# Altium project SNI_PROTO_1.1.PrjPcb
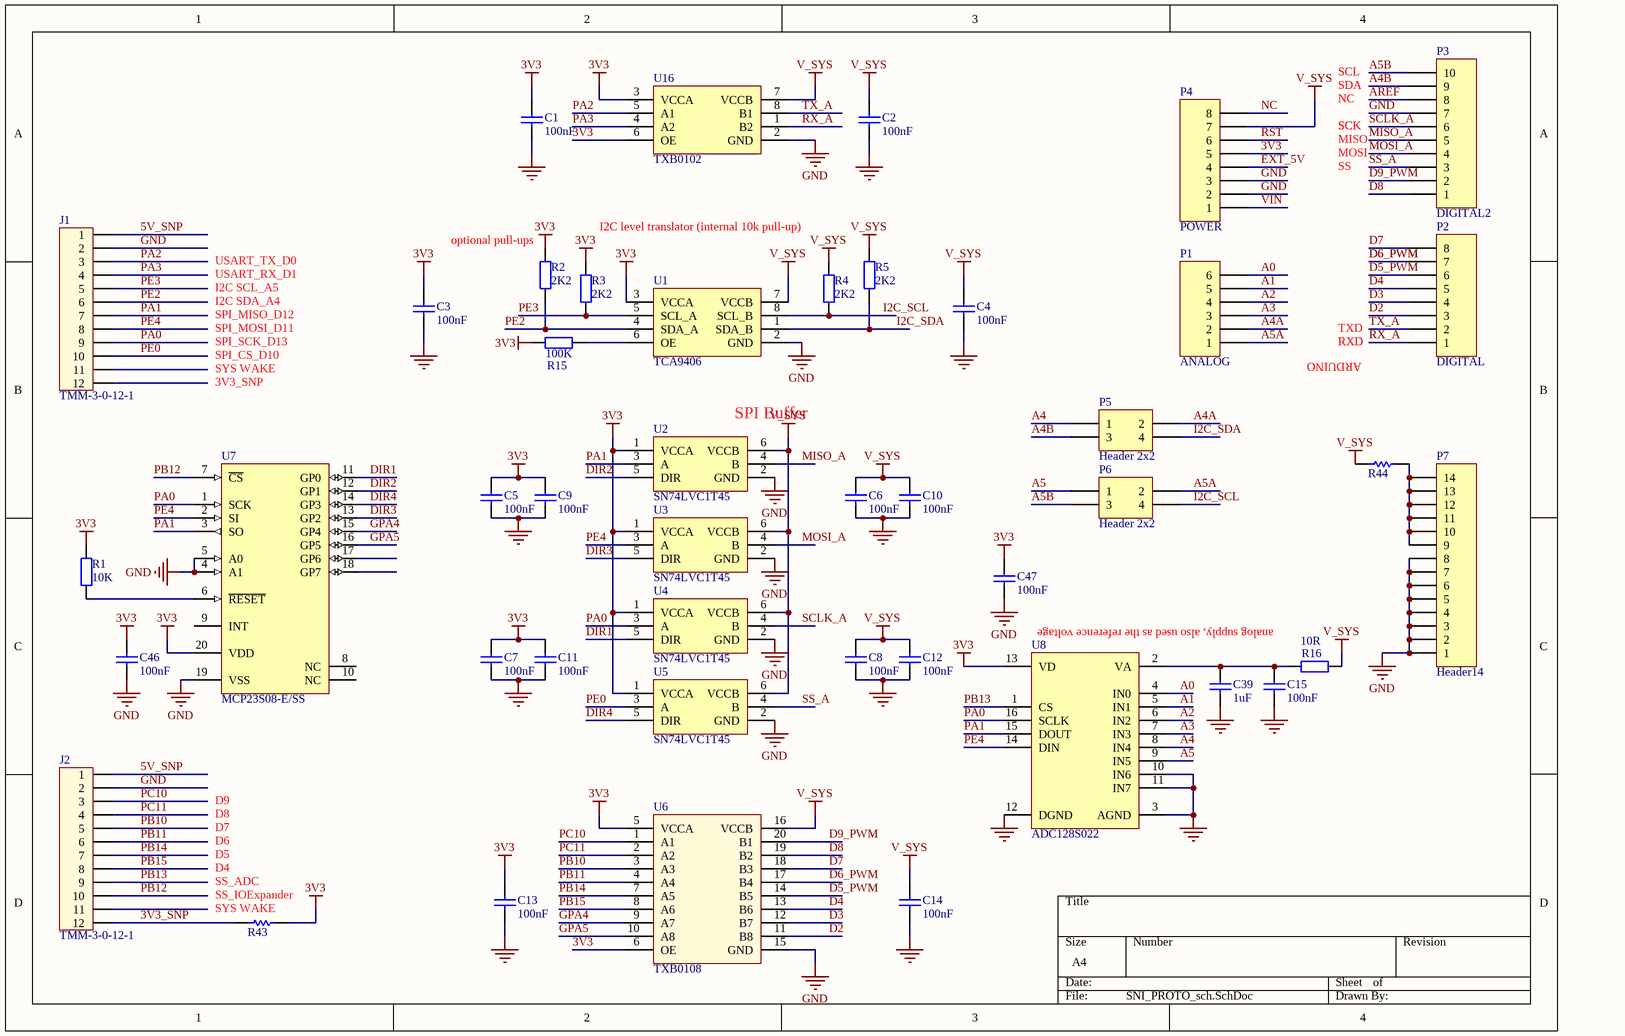
[diagram p0: SNI_PROTO_sch.SchDoc]
3 sheets, 99 parts. Net scope: global (net labels, ports and power ports of the same name join across sheets).
Board file: SNI_PROTO.PcbDoc
Sheets:
  SNI_PROTO_sch.SchDoc
  power.SchDoc
  USB.SchDoc

## Sheet SNI_PROTO_sch.SchDoc
size A4

### Parts
C1  value 100nF  [CAPC0402(1005)60_L]  (hidden comment: CAP 100nF 10V 0402(1005))
C2  value 100nF  [CAPC0402(1005)60_L]  (hidden comment: CAP 100nF 10V 0402(1005))
C3  value 100nF  [CAPC0402(1005)60_L]  (hidden comment: CAP 100nF 10V 0402(1005))
C4  value 100nF  [CAPC0402(1005)60_L]  (hidden comment: CAP 100nF 10V 0402(1005))
C5  value 100nF  [CAPC0402(1005)60_L]  (hidden comment: CAP 100nF 10V 0402(1005))
C6  value 100nF  [CAPC0402(1005)60_L]  (hidden comment: CAP 100nF 10V 0402(1005))
C7  value 100nF  [CAPC0402(1005)60_L]  (hidden comment: CAP 100nF 10V 0402(1005))
C8  value 100nF  [CAPC0402(1005)60_L]  (hidden comment: CAP 100nF 10V 0402(1005))
C9  value 100nF  [CAPC0402(1005)60_L]  (hidden comment: CAP 100nF 10V 0402(1005))
C10  value 100nF  [CAPC0402(1005)60_L]  (hidden comment: CAP 100nF 10V 0402(1005))
C11  value 100nF  [CAPC0402(1005)60_L]  (hidden comment: CAP 100nF 10V 0402(1005))
C12  value 100nF  [CAPC0402(1005)60_L]  (hidden comment: CAP 100nF 10V 0402(1005))
C13  value 100nF  [CAPC0402(1005)60_L]  (hidden comment: CAP 100nF 10V 0402(1005))
C14  value 100nF  [CAPC0402(1005)60_L]  (hidden comment: CAP 100nF 10V 0402(1005))
C15  value 100nF  [CAPC0402(1005)60_L]  (hidden comment: CAP 100nF 10V 0402(1005))
C39  value 1uF  [CAPC0402(1005)60_L]  (hidden comment: CAP 1uF 10V 0402(1005))
C46  value 100nF  [CAPC0402(1005)60_L]  (hidden comment: CAP 100nF 10V 0402(1005))
C47  value 100nF  [CAPC0402(1005)60_L]  (hidden comment: CAP 100nF 10V 0402(1005))
J1  TMM-3-0-12-1  [TMM-3-0-12-1]
J2  TMM-3-0-12-1  [TMM-3-0-12-1]
P1  ANALOG  [H6A]
P2  DIGITAL  [H8A]
P3  DIGITAL2  [H10A]
P4  POWER  [H8A]
P5  Header 2x2  [H2x2]
P6  Header 2x2  [H2x2]
P7  Header14  [H14]
R1  value 10K  [RESC0402(1005)_L]  (hidden comment: 10K 1% 0402(1005))
R2  value 2K2  [RESC0402(1005)_L]  (hidden comment: 2K2 1% 0402(1005))
R3  value 2K2  [RESC0402(1005)_L]  (hidden comment: 2K2 1% 0402(1005))
R4  value 2K2  [RESC0402(1005)_L]  (hidden comment: 2K2 1% 0402(1005))
R5  value 2K2  [RESC0402(1005)_L]  (hidden comment: 2K2 1% 0402(1005))
R15  value 100K  [RESC0402(1005)_L]  (hidden comment: 100K 1% 0402(1005))
R16  value 10R  [RESC0603(1608)_N]  (hidden comment: 10R 1% 0603(1608))
R43  Jumper 0805(2012)  [RESC0805(2012)_N]  (value not drawn)
R44  1R 5% 1210(3225)  [RESC1210(3225)_N]  (value not drawn)
U1  TCA9406  [LSSOP-8]
U2  SN74LVC1T45  [SOT6_DRL]
U3  SN74LVC1T45  [SOT6_DRL]
U4  SN74LVC1T45  [SOT6_DRL]
U5  SN74LVC1T45  [SOT6_DRL]
U6  TXB0108  [UFDFN-20]
U7  MCP23S08-E/SS  [SSOP-SS20_N]
U8  ADC128S022  [TSSOP16]
U16  TXB0102  [VSSOP8]

### Nets
3V3: C1.1 C3.1 C5.1 C7.1 C9.2 C11.2 C13.2 C46.1 C47.1 P4.5 R1.2 R2.2 R3.2 R15.1 R43.2 U1.3(VCCA) U2.1(VCCA) U3.1(VCCA) U4.1(VCCA) U5.1(VCCA) U6.5(VCCA) U6.6(OE) U7.20(VDD) U8.13(VD) U16.3(VCCA) U16.6(OE)
5V_SNP: J1.1 J2.1
EXT_5V: P4.4
GND: C1.2 C2.2 C3.2 C4.2 C5.2 C6.2 C7.2 C8.2 C9.1 C10.1 C11.1 C12.1 C13.1 C14.1 C15.1 C39.1 C46.2 C47.2 J1.2 J2.2 P3.7 P4.2 P4.3 P7.1 P7.2 P7.3 P7.4 P7.5 P7.6 P7.7 P7.8 U1.2(GND) U2.2(GND) U3.2(GND) U4.2(GND) U5.2(GND) U6.15(GND) U7.4(A1) U7.5(A0) U7.19(VSS) U8.3(AGND) U8.10(IN6) U8.11(IN7) U8.12(DGND) U16.2(GND)
V_SYS: C2.1 C4.1 C6.1 C8.1 C10.2 C12.2 C14.2 P4.7 R4.2 R5.2 R16.2 R44.1 U1.7(VCCB) U2.6(VCCB) U3.6(VCCB) U4.6(VCCB) U5.6(VCCB) U6.16(VCCB) U16.7(VCCB)
3V3_SNP: J2.12 R43.1
A0: P1.6 U8.4(IN0)
A1: P1.5 U8.5(IN1)
A2: P1.4 U8.6(IN2)
A3: P1.3 U8.7(IN3)
A4: P5.1 U8.8(IN4)
A4A: P1.2 P5.2
A4B: P3.9 P5.3
A5: P6.1 U8.9(IN5)
A5A: P1.1 P6.2
A5B: P3.10 P6.3
AREF: P3.8
D2: P2.3 U6.11(B8)
D3: P2.4 U6.12(B7)
D4: P2.5 U6.13(B6)
D5_PWM: P2.6 U6.14(B5)
D6_PWM: P2.7 U6.17(B4)
D7: P2.8 U6.18(B3)
D8: P3.1 U6.19(B2)
D9_PWM: P3.2 U6.20(B1)
DIR1: U4.5(DIR) U7.11(GP0)
DIR2: U2.5(DIR) U7.12(GP1)
DIR3: U3.5(DIR) U7.13(GP2)
DIR4: U5.5(DIR) U7.14(GP3)
GPA4: U6.9(A7) U7.15(GP4)
GPA5: U6.10(A8) U7.16(GP5)
I2C_SCL: P6.4 R4.1 U1.8(SCL_B)
I2C_SDA: P5.4 R5.1 U1.1(SDA_B)
MISO_A: P3.5 U2.4(B)
MOSI_A: P3.4 U3.4(B)
NC: P4.8
PA0: J1.9 U4.3(A) U7.1(SCK) U8.16(SCLK)
PA1: J1.7 U2.3(A) U7.3(SO) U8.15(DOUT)
PA2: J1.3 U16.5(A1)
PA3: J1.4 U16.4(A2)
PB10: J2.5 U6.3(A3)
PB11: J2.6 U6.4(A4)
PB12: J2.10 U7.7(~{CS})
PB13: J2.9 U8.1(CS)
PB14: J2.7 U6.7(A5)
PB15: J2.8 U6.8(A6)
PC10: J2.3 U6.1(A1)
PC11: J2.4 U6.2(A2)
PE0: J1.10 U5.3(A)
PE2: J1.6 R2.1 U1.4(SDA_A)
PE3: J1.5 R3.1 U1.5(SCL_A)
PE4: J1.8 U3.3(A) U7.2(SI) U8.14(DIN)
RST: P4.6
RX_A: P2.1 U16.1(B2)
SCLK_A: P3.6 U4.4(B)
SS_A: P3.3 U5.4(B)
TX_A: P2.2 U16.8(B1)
VIN: P4.1
NetC15_2: C15.2 C39.2 R16.1 U8.2(VA)
NetP7_9: P7.9 P7.10 P7.11 P7.12 P7.13 P7.14 R44.2
NetR1_1: R1.1 U7.6(~{RESET})
NetR15_2: R15.2 U1.6(OE)

Not connected (* = marked no-connect by the designer): J1 11 12; J2 11; U7 8(NC) 9(INT) 10(NC) 17(GP6) 18(GP7)

### Notes on the sheet
- SCL
- SDA
- NC
- MISO
- SCK
- MOSI
- SS
- (near R2) optional pull-ups
- I2C level translator (internal 10k pull-up)
- USART_RX_D1
- USART_TX_D0
- I2C SCL_A5
- I2C SDA_A4
- SPI_SCK_D13
- SPI_MOSI_D11
- SPI_MISO_D12
- SPI_CS_D10
- SYS WAKE
- 3V3_SNP
- RXD
- TXD
- ARDUINO
- (near U2) SPI Buffer
- analog supply, also used as the reference voltage
- D6
- D7
- D8
- D9
- (near R43) SS_ADC
- (near R43) SS_IOExpander
- D5
- (near R43) D4
- (near R43) SYS WAKE

### Library data of the parts
C1-C15 C46 C47 = CMP-1034-02064-1: CAP 100nF 10V ±5% 0402 (1005 Metric) Thickness 0.6mm SMD; Tolerance: Â±5%; Case-EIA: 0402; Case-Metric: 1005; Max Thickness: 0.6 mm; Rated Voltage: 10 V; Technology: SMT
C39 = CMP-1034-02117-1: CAP 1uF 10V ±20% 0402 (1005 Metric) Thickness 0.6mm SMD; Case-Metric: 1005; Tolerance: Â±20%; Case-EIA: 0402; Max Thickness: 0.6 mm; Rated Voltage: 10 V; Technology: SMT
J1 J2 = TMM-3-0-12-1: PLUG, DIP, 1.27MM, 12WAY; Manufacturer: AMPHENOL; Supplier 1: Farnell; Supplier Part Number 1: 1865058; Manufacturer Part Number: TMM-3-0-12-1; Supplier 2: Digikey; Supplier 3: Mouser; Supplier Part Number 2: N/A; Supplier Part Number 3: N/A
P1 = header6A
P2 P4 = Header8A
P3 = Header10A
P5 P6 = Header
R1 = 10K 0402(1005)_1: 10K 0.063W 1% 0402 (1005 Metric)  SMD; Case-EIA: 0402; Case-Metric: 1005; Power: 0.063W; Technology: SMT; Tolerance: 1%
R2-R5 = 2K2 0402(1005): 2K2 0.063W 1% 0402 (1005 Metric)  SMD; Case-EIA: 0402; Case-Metric: 1005; Power: 0.063W; Technology: SMT; Tolerance: 1%
R15 = 100K 0402(1005): 100K 0.063W 1% 0402 (1005 Metric)  SMD; Case-EIA: 0402; Case-Metric: 1005; Power: 0.063W; Technology: SMT; Tolerance: 1%
R16 = 10R 0603(1608): 10R 0.1W 1% 0603 (1608 Metric)  SMD; Case-EIA: 0603; Case-Metric: 1608; Power: 0.1W; Technology: SMT; Tolerance: 1%
R43 = CMP-1013-00001-1: Jumper 0805 (2012 Metric); Case-EIA: 0805; Value: 0.00 Ohm; Tolerance: None; Case-Metric: 2012; Technology: SMT; Power: None
R44 = CMP-1015-00002-1: 1R 0.5W 5% 1210 (3225 Metric)  SMD; Case-EIA: 1210; Value: 1.00 Ohm; Case-Metric: 3225; Power: 0.5 W; Technology: SMT; Tolerance: 5 %
U6 = TXB0108: Translator, Bidirectional, 8 bits data rate 100Mbps; Manufacturer Part Number: TXB0108DQSR; Manufacturer: Texas Instruments; Supplier Part Number 1: 2352272; Supplier Part Number 2: 296-27217-1-ND; Supplier 1: Farnell; Supplier 2: Digikey; ComponentLink1URL: http://www.ti.com/lit/ds/symlink/txb0108.pdf; ComponentLink1Description: Datasheet; Supplier 3: Mouser; Supplier Part Number 3: 595-TXB0108DQSR; Mounting Style: SMD/SMT
U7 = MCP23S08-E/SS: 8-Bit I/O Expander with Serial Interface, 20-Pin SSOP, Extended Temperature; Published: 29-Jan-2009; DatasheetVersion: revE, Aug-2007; PackageVersion: revBB, Aug-2009; PackageReference: SSOP-SS20; Publisher: Altium Limited; PackageDescription: 20-Lead Plastic Shrink Small Outline (SS) - 5.3mm Body [SSOP]; Supplier 1: Digi-Key; Supplier Part Number 1: MCP23S08-E/SS-ND; Supplier 2: Farnell; Supplier Part Number 2: 1292236; Code_JEDEC: MO-150; Code_IPC: SOP65P780-20; ComponentLink1Description: Datasheet; ComponentLink1URL: http://ww1.microchip.com/downloads/en/DeviceDoc/21919e.pdf; ComponentLink2Description: Packaging Specification; ComponentLink2URL: http://www.microchip.com/stellent/groups/techpub_sg/documents/packagingspec/en012702.pdf; ComponentLink3Description: Microchip.com Home; ComponentLink3URL: http://www.microchip.com/
U1 = TCA9406: Supplier 1: Farnell; Supplier 2: Digi-Key; Supplier 3: Mouser; Supplier Part Number 1: 1972384; Supplier Part Number 2: 296-28108-1-ND; Supplier Part Number 3: 595-TCA9406DCTR
U2-U5 = SN74LVC1T45: Supplier 1: Farnell; Supplier 2: Digi_Key; Supplier 3: Mouser; Supplier Part Number 1: N/A; Supplier Part Number 2: 296-20629-1-ND; Supplier Part Number 3: 595-SN74LVC1T45DRLR
U8 = ADC128S022: Supplier 1: Farnell; Supplier 2: Digi-Key; Supplier 3: Mouser; Supplier Part Number 1: 2496156; Supplier Part Number 2: 296-38561-2-ND; Supplier Part Number 3: 926-A128S022CIMTXNPB
U16 = TXB0102: Supplier 1: Farnell; Supplier 2: Digi_Key; Supplier 3: Mouser; Supplier Part Number 1: 2295723; Supplier Part Number 3: 595-TXB0102DCUR; Supplier Part Number 2: 296-22862-1-ND

## Sheet power.SchDoc
size A4
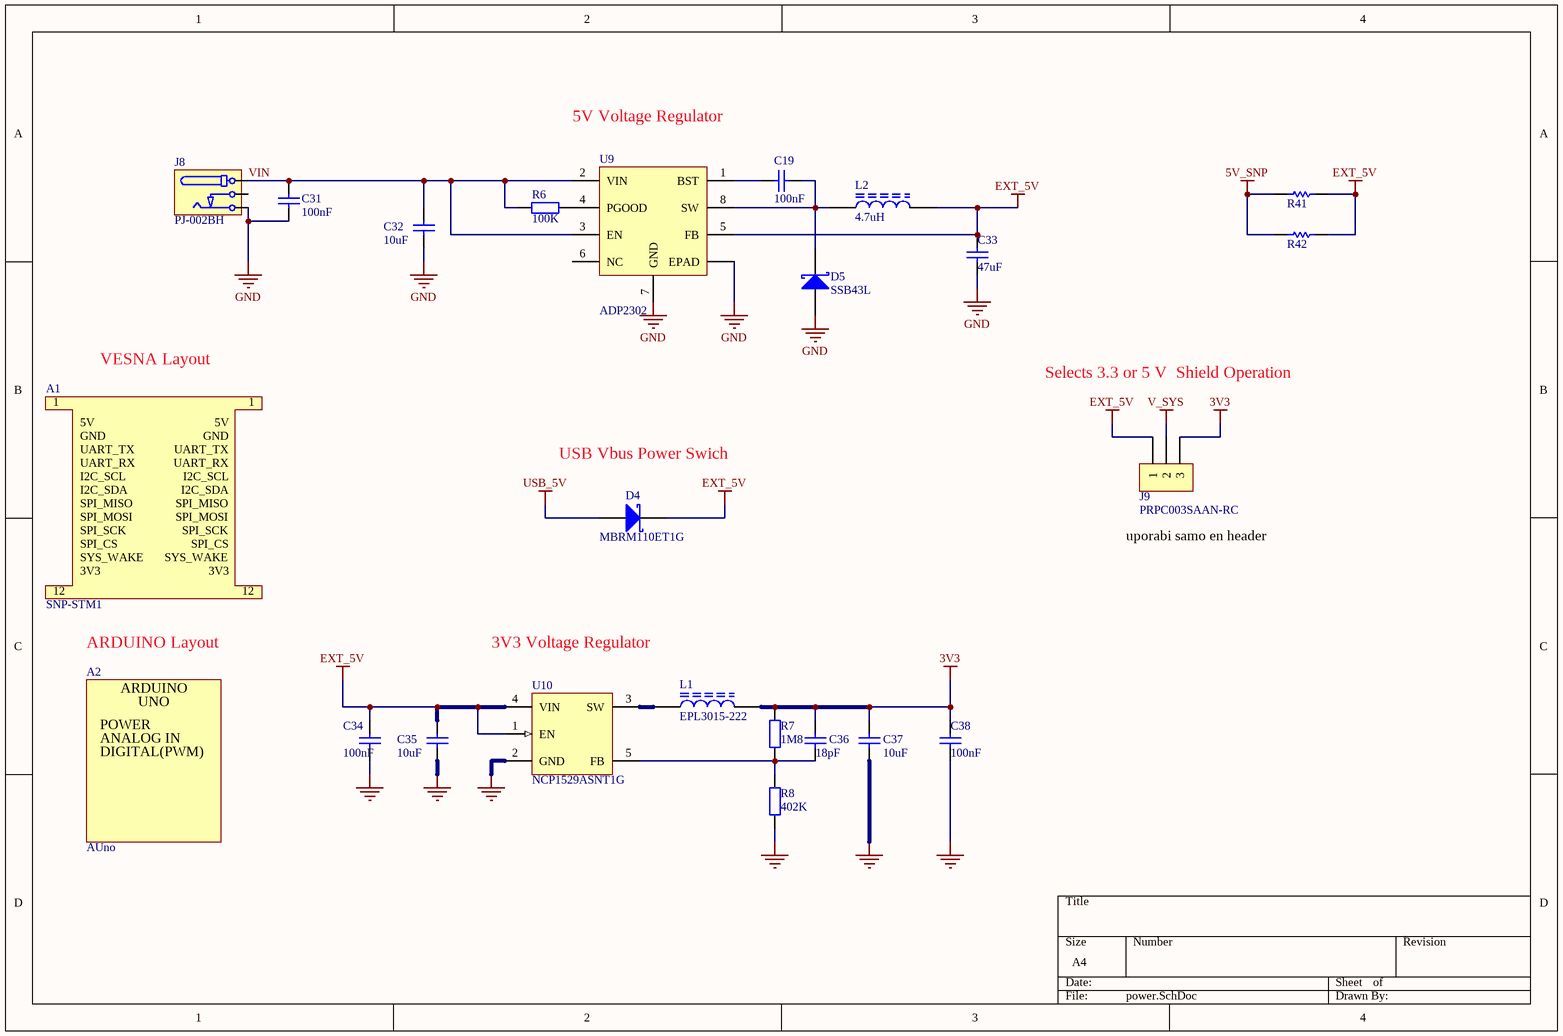
[diagram p1: power.SchDoc]

### Parts
A1  SNP-STM1  [SNP-STM1]  (no BOM)
A2  AUno  [PCBComponent_1]
C19  value 100nF  [CAPC0402(1005)60_L]  (hidden comment: CAP 100nF 10V 0402(1005))
C31  value 100nF  [CAPC0402(1005)60_M]  (hidden comment: CAP 100nF 50V 0402(1005))
C32  10uF  [CAPC0805(2012)145_N]
C33  value 47uF  [CAPC0402(1005)60_M]  (hidden comment: CAP 100nF 50V 0402(1005))
C34  value 100nF  [CAPC0402(1005)60_M]  (hidden comment: CAP 100nF 50V 0402(1005))
C35  10uF  [CAPC0805(2012)145_N]
C36  value 18pF  [CAPC0402(1005)60_M]  (hidden comment: CAP 18pF 50V 0402(1005))
C37  10uF  [CAPC0805(2012)145_N]
C38  value 100nF  [CAPC0402(1005)60_M]  (hidden comment: CAP 100nF 50V 0402(1005))
D4  MBRM110ET1G  [CASE 457–04]
D5  SSB43L  [CASE 457–04]
J8  PJ-002BH  [PJ-002BH]
J9  PRPC003SAAN-RC  [PRPC003SAAN-RC]
L1  EPL3015-222  [EPL3015-222_L]
L2  4.7uH  [EPL3015-222_L]
R6  value 100K  [RESC0402(1005)_M]  (hidden comment: 100K 1% 0402(1005))
R7  value 1M8  [RESC0402(1005)_L]  (hidden comment: 1M8 1% 0402(1005))
R8  value 402K  [RESC0402(1005)_L]  (hidden comment: 402K 1% 0402(1005))
R41  Jumper 0805(2012)  [RESC0805(2012)_N]  (value not drawn)
R42  Jumper 0805(2012)  [RESC0805(2012)_N]  (value not drawn)
U9  ADP2302  [SOP127P600-8N]
U10  NCP1529ASNT1G  [SOT-23-5_L]

### Nets
3V3: C36.2 C37.2 C38.2 J9.3 L1.2 R7.2
5V_SNP: R41.1 R42.1
EXT_5V: C33.2 C34.2 C35.2 D4.1(K) J9.1 L2.2 R41.2 R42.2 U9.5(FB) U10.1(EN) U10.4(VIN)
GND: C31.2 C32.1 C33.1 C34.1 C35.1 C37.1 C38.1 D5.2(A) J8.2(T) R8.1 U9.7(GND) U9.9(EPAD) U10.2(GND)
USB_5V: D4.2(A)
V_SYS: J9.2
VIN: C31.1 C32.2 J8.1(S) R6.1 U9.2(VIN) U9.3(EN)
NetC19_1: C19.1 U9.1(BST)
NetC19_2: C19.2 D5.1(K) L2.1 U9.8(SW)
NetC36_1: C36.1 R7.1 R8.2 U10.5(FB)
NetL1_1: L1.1 U10.3(SW)
NetR6_2: R6.2 U9.4(PGOOD)

Not connected (* = marked no-connect by the designer): J8 3(R); U9 6(NC)

### Notes on the sheet
- 5V Voltage Regulator
- VESNA Layout
- Selects 3.3 or 5 V  Shield Operation
- USB Vbus Power Swich
- uporabi samo en header
- ARDUINO Layout
- 3V3 Voltage Regulator
- (in symbol AUno) ARDUINO; UNO; POWER; ANALOG IN; DIGITAL(PWM)
- (in symbol SNP-STM1) 1; 5V; GND; UART_TX; UART_RX; I2C_SCL; I2C_SDA; SPI_MISO; SPI_MOSI; SPI_SCK; SPI_CS; SYS_WAKE; 3V3; 12

### Library data of the parts
A1 = SNP-STM1: SNP-STM1 Vesna Processor Module, Mechanical PCB Components without Connectors
C19 = CMP-1034-02064-1: as C1 on sheet SNI_PROTO_sch; Max Thickness: 0.6 mm; Rated Voltage: 10 V; Technology: SMT
C31 C33 C34 C38 = CMP-1034-02077-1: CAP 100nF 50V ±10% 0402 (1005 Metric) Thickness 0.6mm SMD; Case-Metric: 1005; Case-EIA: 0402; Rated Voltage: 50 V; Technology: SMT; Tolerance: ±10%; Max Thickness: 0.6 mm
C32 C35 C37 = CMP-1036-04924-1: CAP 10uF 10V ±20% 0805 (2012 Metric) Thickness 1.45mm SMD; Case-EIA: 0805; Case-Metric: 2012; Rated Voltage: 10 V; Max Thickness: 1.45 mm; Value: 10uF; Technology: SMT; Tolerance: ±20%
C36 = CMP-1034-00862-1: CAP 18pF 50V ±1% 0402 (1005 Metric) Thickness 0.6mm SMD; Case-Metric: 1005; Case-EIA: 0402; Tolerance: ±1%; Max Thickness: 0.6 mm; Technology: SMT; Rated Voltage: 50 V
D4 D5 = MBRM110ET1G: Diode, Schottky Power Rectifier, SMT, 1A, 10V; Supplier 1: Farnell; Supplier 2: Digi-Key; Supplier 3: Mouser; Supplier Part Number 1: 2369429; Supplier Part Number 2: MBRM110ET1GOSCT-ND; Supplier Part Number 3: 863-MBRM110ET1G
J9 = PRPC003SAAN-RC: Pin header male 3 pin  Through Hole Vertical, Pitch 2.54 mm; Supplier Part Number 1: *; Supplier Part Number 2: S1011EC-40-ND; Supplier Part Number 3: *; Supplier 1: Farnell; Supplier 2: Digi-key; Supplier 3: Mouser
L1 = EPL3015-222: Shielded Power Inductors, 2.2uH, Isat 1.6A @ 30%, Irms 2A @ 40°C, 3 x 3 x 1.5mm; Supplier 1: Farnell; Supplier 2: Mouser; Supplier Part Number 1: 2287410; Supplier Part Number 2: 994-EPL3015-222MLB
L2 = EPL3015-472MLB: Shielded Power Inductors, 4.7uH, Isat 1.6A @ 30%, Irms 1.4A @ 40°C, 3 x 3 x 1.5mm; Manufacturer: COILCRAFT; Supplier 1: Farnell; Supplier 2: Mouser; Supplier Part Number 1: 2287412; Supplier Part Number 2: 994-EPL3015-472MLB; ComponentLink1URL: http://www.farnell.com/datasheets/1681919.pdf; ComponentLink1Description: Datasheet; Manufacturer Part Number: EPL3015-472MLB; Supplier 3: *; Supplier Part Number 3: *
R6 = 100K 0402(1005): as R15 on sheet SNI_PROTO_sch; Power: 0.063W; Technology: SMT; Tolerance: 1%
R7 = 1M8 0402(1005): 1M8 0.063W 1% 0402 (1005 Metric)  SMD; Case-EIA: 0402; Case-Metric: 1005; Power: 0.063W; Technology: SMT; Tolerance: 1%
R8 = 402K 0402(1005): 402K 0.063W 1% 0402 (1005 Metric)  SMD; Case-EIA: 0402; Case-Metric: 1005; Power: 0.063W; Technology: SMT; Tolerance: 1%
R41 R42 = CMP-1013-00001-1: as R43 on sheet SNI_PROTO_sch; Technology: SMT; Power: None
U10 = NCP1529A: 1 A, 1.7 MHz Low Voltage Buck Converter; Supplier 1: Farnell; Supplier 2: Digi-Key; Supplier 3: Mouser; Supplier Part Number 1: 2112613; Supplier Part Number 2: NCP1529ASNT1GOSCT-ND; Supplier Part Number 3: 863-NCP1529ASNT1G
J8 = PJ-002BH: Supplier Part Number 2: CP-002BH-ND; Supplier 2: Digi-Key; Supplier Part Number 3: 490-PJ-002BH; Supplier Part Number 1: *; Supplier 1: Farnell; Supplier 3: Mouser
U9 = ADP2302: Supplier 1: Farnell; Supplier 2: Digi-Key; Supplier 3: Maouser; Supplier Part Number 3: 584-ADP2302ARDZ5.0R7; Supplier Part Number 2: ADP2302ARDZ-5.0-R7TR-ND; Supplier Part Number 1: *

## Sheet USB.SchDoc
size A4
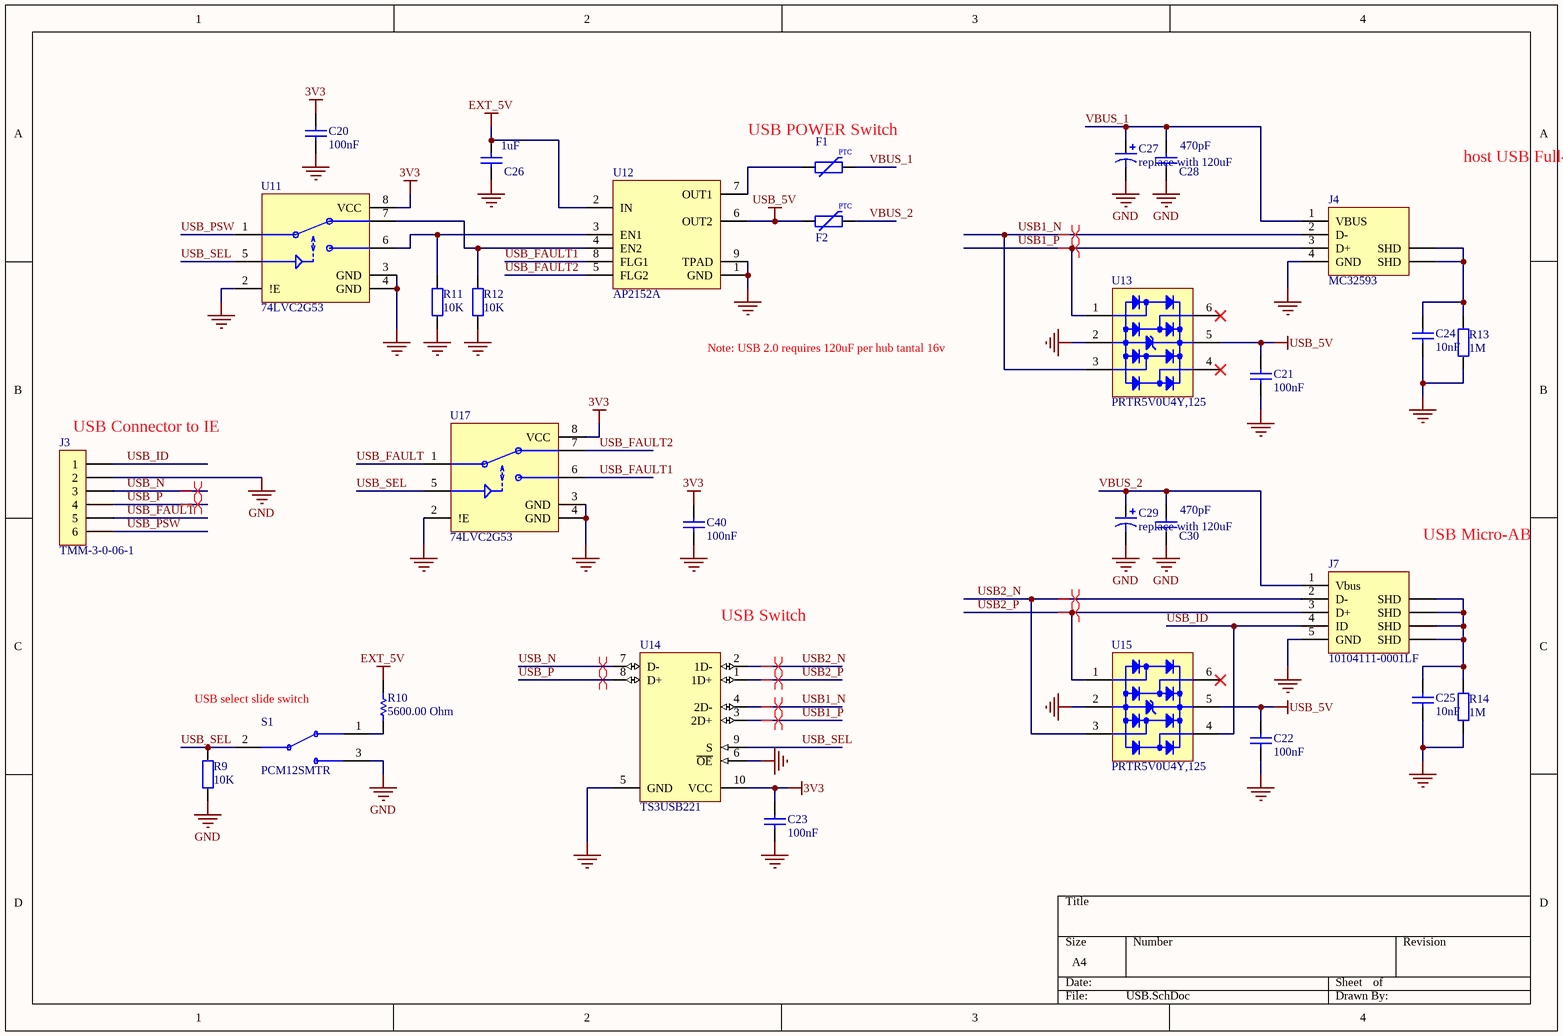
[diagram p2: USB.SchDoc]

### Parts
C20  value 100nF  [CAPC0402(1005)60_L]  (hidden comment: CAP 100nF 10V 0402(1005))
C21  value 100nF  [CAPC0402(1005)60_L]  (hidden comment: CAP 100nF 10V 0402(1005))
C22  value 100nF  [CAPC0402(1005)60_L]  (hidden comment: CAP 100nF 10V 0402(1005))
C23  value 100nF  [CAPC0402(1005)60_L]  (hidden comment: CAP 100nF 10V 0402(1005))
C24  value 10nF  [CAPC0402(1005)60_N]  (hidden comment: CAP 10nF 50V 0402(1005))
C25  value 10nF  [CAPC0402(1005)60_N]  (hidden comment: CAP 10nF 50V 0402(1005))
C26  value 1uF  [CAPC0603(1608)100_N]  (hidden comment: CAP 2.2uF 16V 0603(1608))
C27  replace with 120uF  [AVX-CAPC3528_V]
C28  value 470pF  [CAPC0603(1608)100_M]  (hidden comment: CAP 470pF 16V 0603(1608))
C29  replace with 120uF  [AVX-CAPC3528_V]
C30  value 470pF  [CAPC0603(1608)100_M]  (hidden comment: CAP 470pF 16V 0603(1608))
C40  value 100nF  [CAPC0402(1005)60_L]  (hidden comment: CAP 100nF 10V 0402(1005))
F1  MF-PSMF050X-2  [RESC0805(2012)_L]  (value not drawn)
F2  MF-PSMF050X-2  [RESC0805(2012)_L]  (value not drawn)
J3  TMM-3-0-06-1  [Micro-Match_6pin]
J4  MC32593  [MC32593]
J7  10104111-0001LF  [10104111-0001LF]
R9  value 10K  [RESC0402(1005)_L]  (hidden comment: 10K 1% 0402(1005))
R10  value 5600.00 Ohm  [RESC0402(1005)_L]  (hidden comment: 5K6 5% 0402(1005))
R11  value 10K  [RESC0402(1005)_N]  (hidden comment: 10K 1% 0402(1005))
R12  value 10K  [RESC0402(1005)_N]  (hidden comment: 10K 1% 0402(1005))
R13  value 1M  [RESC0402(1005)_L]  (hidden comment: 1M  1% 0402(1005))
R14  value 1M  [RESC0402(1005)_L]  (hidden comment: 1M  1% 0402(1005))
S1  PCM12SMTR  [PCM12SMTR switch footprint]
U11  74LVC2G53  [VSSOP8_SOT765-1]
U12  AP2152A  [SOP127P600-8N]
U13  PRTR5V0U4Y,125  [SOT363_L]
U14  TS3USB221  [RSE10]
U15  PRTR5V0U4Y,125  [SOT363_L]
U17  74LVC2G53  [VSSOP8_SOT765-1]

### Nets
3V3: C20.2 C23.2 C40.2 U11.8(VCC) U14.10(VCC) U17.8(VCC)
EXT_5V: C26.2 R10.2 U12.2(IN)
GND: C20.1 C21.1 C22.1 C23.1 C24.1 C25.1 C26.1 C27.2 C28.1 C29.2 C30.1 C40.1 J3.2 J4.4(GND) J7.5(GND) R9.1 R11.1 R12.1 R13.1 R14.1 S1.3(NC2) U11.2(!E) U11.3(GND) U11.4(GND) U12.1(GND) U12.9(TPAD) U13.2 U14.5(GND) U14.6(~{OE}) U15.2 U17.2(!E) U17.3(GND) U17.4(GND)
USB_5V: C21.2 C22.2 F2.1 U12.6(OUT2) U13.5 U15.5
USB1_N: J4.2(D-) U13.3 U14.4(2D-)
USB1_P: J4.3(D+) U13.1 U14.3(2D+)
USB2_N: J7.2(D-) U14.2(1D-) U15.3
USB2_P: J7.3(D+) U14.1(1D+) U15.1
USB_FAULT: J3.5 U17.1(Z)
USB_FAULT1: U12.8(FLG1) U17.6(Y1)
USB_FAULT2: U12.5(FLG2) U17.7(Y0)
USB_ID: J3.1 J7.4(ID) U15.4
USB_N: J3.3 U14.7(D-)
USB_P: J3.4 U14.8(D+)
USB_PSW: J3.6 U11.1(Z)
USB_SEL: R9.2 S1.2(NO1) U11.5(S) U14.9(S) U17.5(S)
VBUS_1: C27.1 C28.2 F1.2 J4.1(VBUS)
VBUS_2: C29.1 C30.2 F2.2 J7.1(Vbus)
NetC24_2: C24.2 J4.5(SHD) J4.6(SHD) R13.2
NetC25_2: C25.2 J7.6(SHD) J7.7(SHD) J7.8(SHD) J7.9(SHD) R14.2
NetF1_1: F1.1 U12.7(OUT1)
NetR10_1: R10.1 S1.1(NC1)
NetR11_2: R11.2 U11.6(Y1) U12.3(EN1)
NetR12_2: R12.2 U11.7(Y0) U12.4(EN2)

Not connected (* = marked no-connect by the designer): U13 4* 6*; U15 6*

### Layout directives
differential pair: USB1_N, USB1_P, USB2_N, USB2_P, USB_N, USB_P

### Notes on the sheet
- USB POWER Switch
- host USB Full-size type A
- Note: USB 2.0 requires 120uF per hub tantal 16v
- (near J3) USB Connector to IE
- (near J7) USB Micro-AB
- (near U14) USB Switch
- (near S1) USB select slide switch
- (in symbol MF-PSMF050X-2) PTC

### Library data of the parts
C20-C23 C40 = CMP-1034-02064-1: as C1 on sheet SNI_PROTO_sch; Max Thickness: 0.6 mm; Rated Voltage: 10 V; Technology: SMT
C24 C25 = CMP-1034-01886-1: CAP 10nF 50V ±10% 0402 (1005 Metric) Thickness 0.6mm SMD; Case-EIA: 0402; Case-Metric: 1005; Tolerance: ±10%; Rated Voltage: 50 V; Max Thickness: 0.6 mm; Technology: SMT
C26 = CMP-1035-02765-1: CAP 2.2uF 16V ±20% 0603 (1608 Metric) Thickness 1mm SMD; Case-EIA: 0603; Case-Metric: 1608; Max Thickness: 1 mm; Rated Voltage: 16 V; Tolerance: ±20%; Technology: SMT
C27 C29 = CMP-0279-00001-1: Capacitor, Tantalum, 10uF 10% 20V MCCT-B (3528); PartNumber: TAJB106K020R; Manufacturer: AVX; Polarity: Polarized; PackageDescription: 2-Pin SMT Capacitor, 3.5 x 2.8 mm Body; ComponentLink1URL: http://www.avx.com/; PackageReference: CAPC3528; ComponentLink2Description: Datasheet; Capacitance: 10uF; Technology: Tantalum; ComponentLink2URL: http://www.avx.com/docs/Catalogs/taj.pdf; Tolerance: 10%; ComponentLink1Description: Manufacturer URL; Rated Voltage: 20V; DatasheetVersion: Jun-13; Mounting Technology: Surface Mount
C28 C30 = CMP-1035-01663-1: CAP 470pF 16V ±1% 0603 (1608 Metric) Thickness 1mm SMD; Case-EIA: 0603; Case-Metric: 1608; Tolerance: Â±1%; Technology: SMT; Rated Voltage: 16 V; Max Thickness: 1 mm
F1 = MF-PSMF050X-2: PTC Resettable Fuse; Manufacturer: Bourns; Hold Current: 0.5 A; Resistance: 900 mOhms; Maximum Voltage: 6 VDC; Type: PTC Resettable Fuses; Current Rating - Max: 40 A; Trip Current: 1 A; Supplier 1: Farnell; Supplier 2: Digi-Key; Supplier 3: Mouser; Supplier Part Number 1: 1294876; Supplier Part Number 2: MF-PSMF050X-2CT-ND; Supplier Part Number 3: 652-MF-PSMF050X-2; Dimensions: 2.3 mm L x 1.5 mm W x 0.85 mm  H; Mounting Style: SMD/SMT; Package/Case: 0805 (2012 metric); Operating Temperature Range: - 40 C to + 85 C; Manufacturer Part Number: MF-PSMF050X-2
F2 = MF-PSMF050X-2: PTC Resettable Fuse; CurrentTrip: 1A; CurrentHold: 0.5A; Supplier 1: Farnell; Supplier 2: Digi-Key; Supplier 3: Mouser; Supplier Part Number 1: 1294876; Supplier Part Number 2: MF-PSMF050X-2CT-ND; Supplier Part Number 3: 652-MF-PSMF050X-2
J3 = TMM-3-0-06-1: Micro-Match male 6 pin  Through Hole Vertical, Pitch 1.27mm; Manufacturer: AMPHENOL; Supplier Part Number 1: 1865054; Supplier Part Number 2: N/A; Supplier Part Number 3: N/A; Supplier 1: Farnell; Supplier 2: Digi-key; Supplier 3: Mouser; Manufacturer Part Number: TMM-3-0-06-1
J4 = MC32593: USB, Type A, Right Angle, THT; Manufacturer: MULTICOMP; Supplier 1: Farnell; Supplier Part Number 1: 1696534; Manufacturer Part Number: MC32593; ComponentLink1URL: http://www.farnell.com/cad/328899.pdf; ComponentLink1Description: Datasheet; Supplier 2: Digikey; Supplier 3: Mouser; Supplier Part Number 2: N/A; Supplier Part Number 3: N/A
J7 = 10104111-0001LF: Micro USB 2.0, Type AB, Bottom Mount, SMT, Right Angle; Supplier 1: Farnell; Supplier 2: Digi-Key; Supplier 3: Mouser; Supplier Part Number 1: 2293755; Supplier Part Number 2: 609-4053-1-ND; Supplier Part Number 3: 649-10104111-0001LF
R9 R11 R12 = 10K 0402(1005)_1: as R1 on sheet SNI_PROTO_sch; Power: 0.063W; Technology: SMT; Tolerance: 1%
R10 = CMP-1011-00092-1: 5K6 0.063W 5% 0402 (1005 Metric)  SMD; Case-EIA: 0402; Case-Metric: 1005; Technology: SMT; Tolerance: 5 %; Power: 0.063 W
R13 R14 = 1M 0402(1005): 1M  0.063W 1% 0402 (1005 Metric)  SMD; Case-EIA: 0402; Case-Metric: 1005; Power: 0.063W; Technology: SMT; Tolerance: 1%
S1 = PCM12SMTR: slide switch; Manufacturer: C & K COMPONENTS; Supplier 1: Farnell; Supplier 2: Digi-Key; Supplier 3: Mouser; Supplier Part Number 1: 9575146; Supplier Part Number 2: 401-2016-1-ND; Supplier Part Number 3: 611-PCM12SMTR; Manufacturer Part Number: PCM12SMTR
U13 U15 = PRTR5V0U4Y,125: Integrated quad ultra-low capacitance ESD protection,  IEC 61000-4-2 level 4, ±8 kV contact discharge; Manufacturer: NXP; Supplier 1: Farnell; Supplier 2: Digi-Key; Supplier 3: Mouser; Supplier Part Number 1: 1757870; Supplier Part Number 2: 568-6542-1-ND; Supplier Part Number 3: 771-PRTR5V0U4Y125; ComponentLink1URL: http://www.farnell.com/datasheets/460678.pdf; ComponentLink1Description: Datasheet; Minimum Operating Temperature: - 40 C; Mounting Style: SMD/SMT; Manufacturer Part Number: PRTR5V0U4Y,125; Dimensions: 1.35 mm W x 2.2 mm L x 1 mm H; Maximum Operating Temperature: + 85 C
U14 = CMP-0309-00017-1: ESD Protected,High-Speed USB 2.0 (480-Mbps) 1:2 Multiplexer / Demultiplexer Switch, 1:2 Mux / Demux, 6 ohm RON, 2.5 to 3.3V, -40 to 85 degC, 10-Pin UQFN (RSE), Green (RoHS & no Sb/Br); PartNumber: TS3USB221ARSER; Manufacturer: Texas Instruments; ron(max)(ohms): 6; ESD HBM(kV): +/-7; ICC(uA): 30; Architecture: "1","2 mux/demux"; tpd max(ns): 0.25; OFF Time(Max)(ns): 12; Bandwidth(MHz): 900; Vcc range(V): 2.3 to 3.6; RON Mis-match(Max)(Ohms): 0.2; RON Flatness(Max)(Ohms): 1; IL OFF(Max)(nA): 2; SubFamily: USB Switch; Mounting Technology: Surface Mount; Code_JEDEC: MO-288-UEFD; ComponentLink2URL: http://www.ti.com/lit/ml/mpqf186c/mpqf186c.pdf; Eco-Plan: Green (RoHS & no Sb/Br); PackageVersion: revD, Jan-2011; PackageDescription: 10-Leads Plastic Quad Flatpack No-Lead, 2 x 1.5 x 0.55 mm Body, 0.5 mm Pitch; ComponentLink1Description: Datasheet; ON Time(Max)(ns): 30; DatasheetVersion: SCDS277; ComponentLink2Description: Package Specification; PackageReference: RSE10; Number of Channels: 2; ComponentLink1URL: http://www.ti.com/general/docs/lit/getliterature.tsp?genericPartNumber=TS3USB221A&fileType=pdf
U11 U17 = 74LVC2G53: Supplier 1: Farnell; Supplier 2: Digi-Key; Supplier 3: Mouser; Supplier Part Number 1: N/A; Supplier Part Number 2: 74LVC2G53DC,125-ND; Supplier Part Number 3: 771-LVC2G53DC125
U12 = AP2152A: Supplier 1: Farnell; Supplier 2: Digi-Key; Supplier 3: Mouser; Supplier Part Number 2: AP2152AMPG-13DITR-ND; Supplier Part Number 3: 621-AP2152AMPG-13

## Nets that join several sheets
3V3: SNI_PROTO_sch (26 pins), power (6 pins), USB (6 pins)
5V_SNP: SNI_PROTO_sch (J1.1 J2.1), power (R41.1 R42.1)
EXT_5V: SNI_PROTO_sch (P4.4), power (11 pins), USB (C26.2 R10.2 U12.2)
GND: SNI_PROTO_sch (45 pins), power (13 pins), USB (33 pins)
USB_5V: power (D4.2), USB (6 pins)
V_SYS: SNI_PROTO_sch (19 pins), power (J9.2)
VIN: SNI_PROTO_sch (P4.1), power (6 pins)